# Altium project ControlPlate_V0.03.PrjPcb
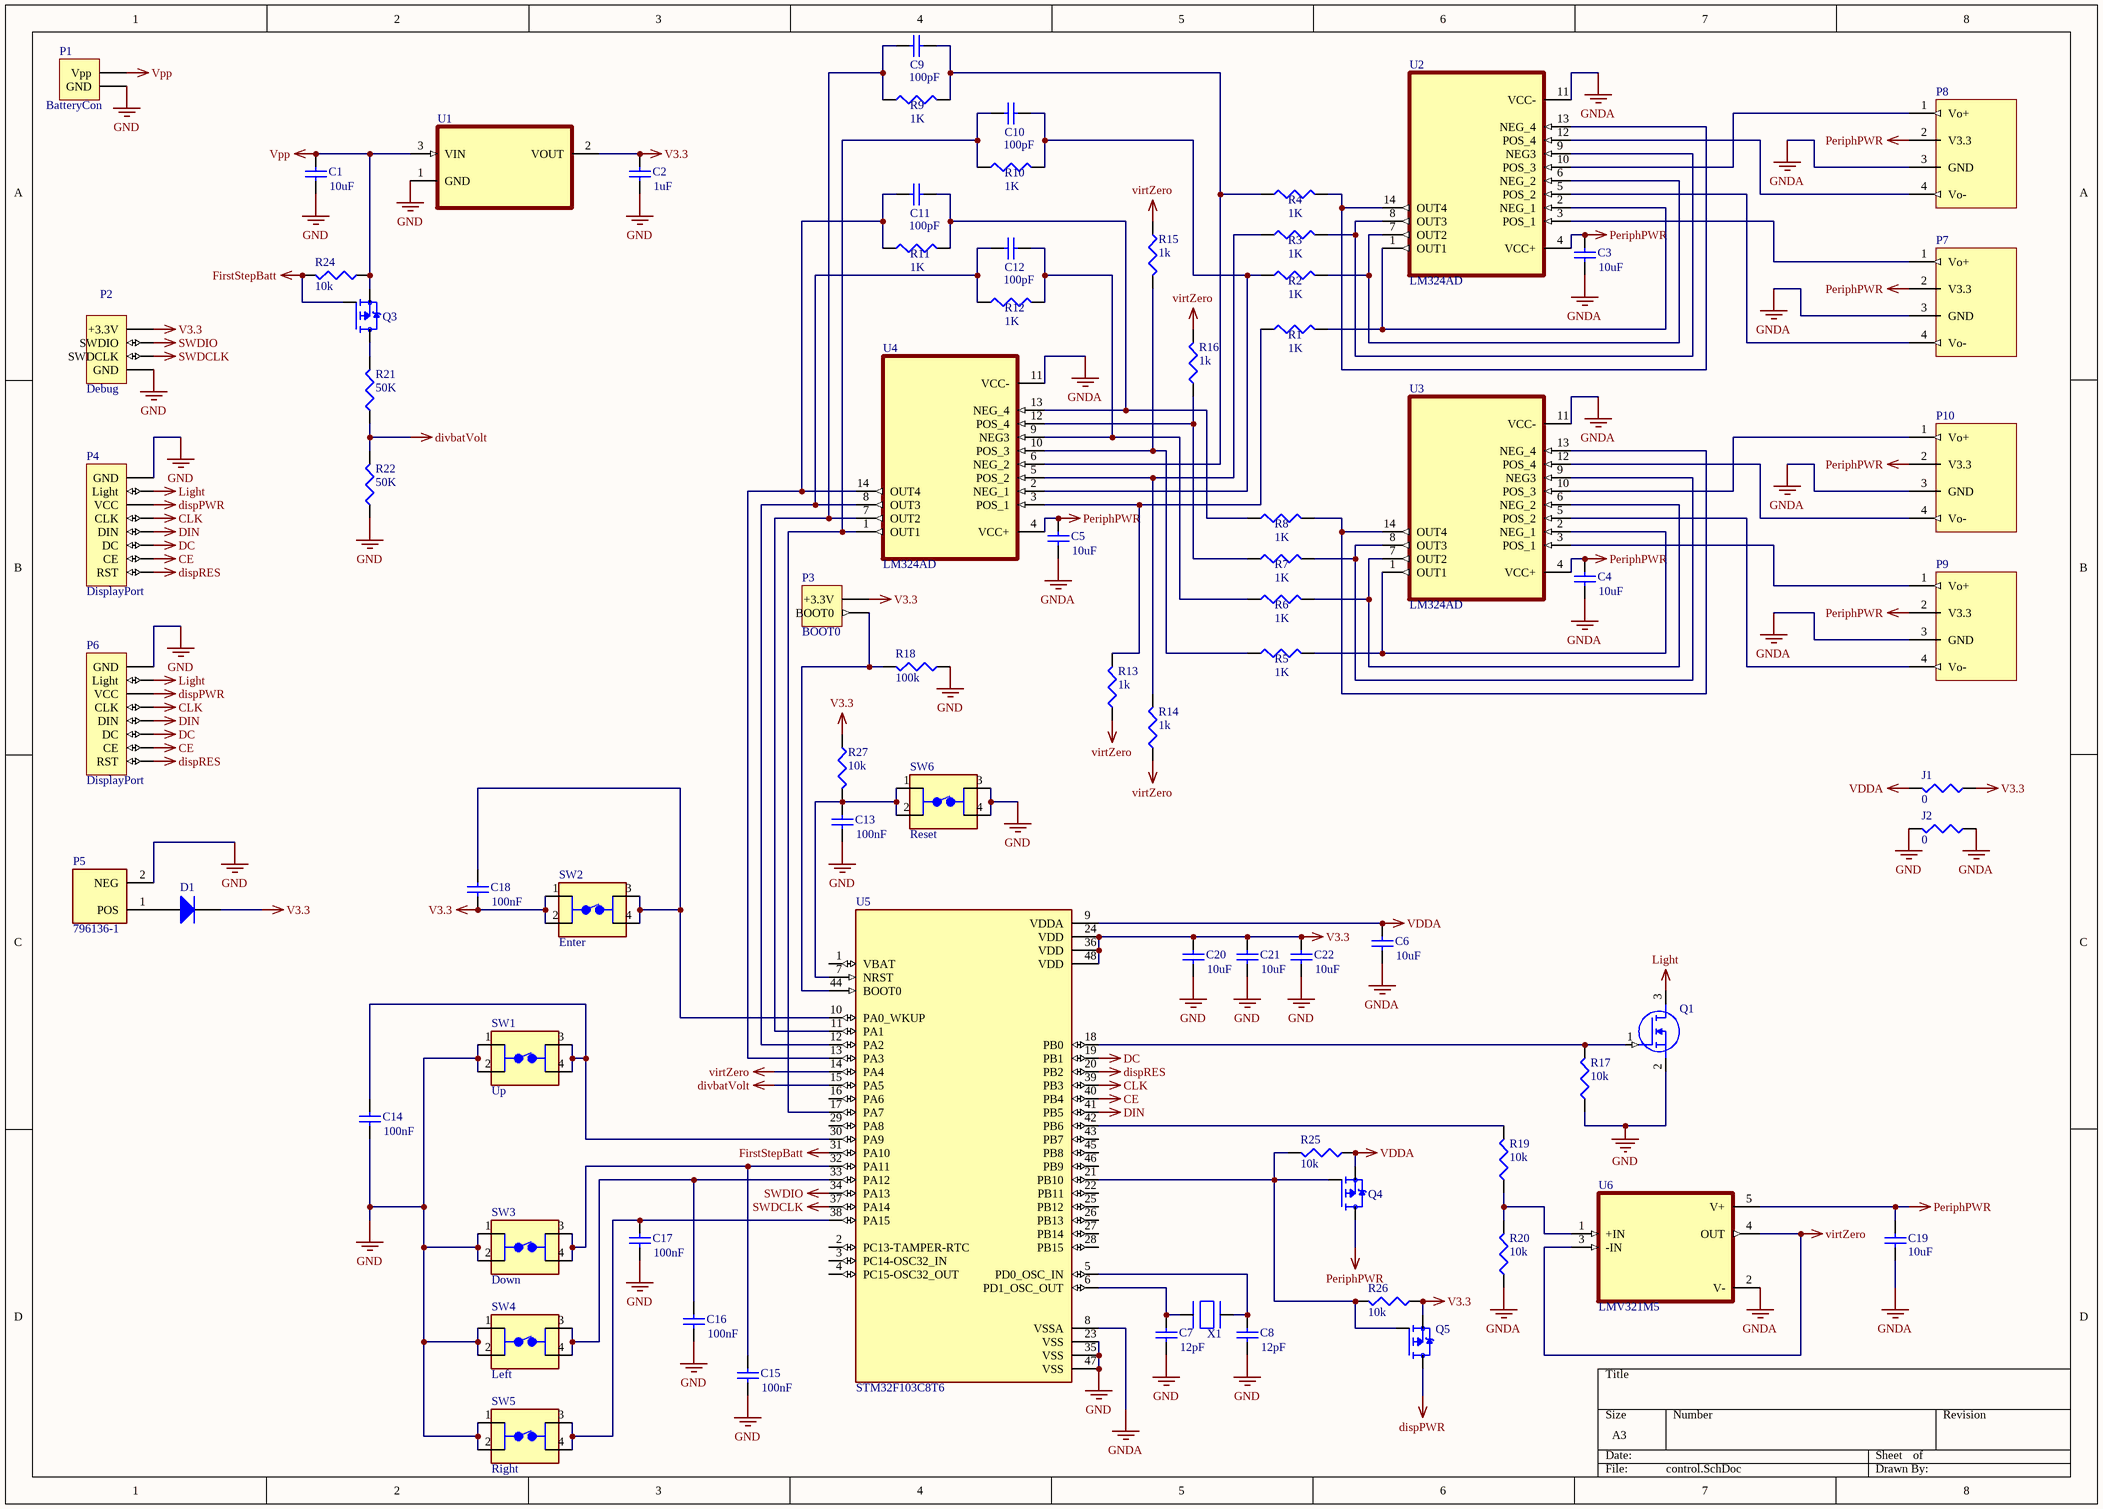
[diagram p0: control.SchDoc]
1 sheet, 78 parts. Net scope: global (net labels, ports and power ports of the same name join across sheets).
Board file: control.PcbDoc

## Sheet control.SchDoc
size A3; CheckedBy: Harakivi; Author: Harakivi; DrawnBy: Harakivi

### Parts
C1  value 10uF  [C1206]  (hidden comment: Cap Semi)
C2  value 1uF  [C1206]  (hidden comment: Cap Semi)
C3  value 10uF  [C1206]  (hidden comment: Cap Semi)
C4  value 10uF  [C1206]  (hidden comment: Cap Semi)
C5  value 10uF  [C1206]  (hidden comment: Cap Semi)
C6  value 10uF  [C1206]  (hidden comment: Cap Semi)
C7  value 12pF  [C1206]  (hidden comment: Cap Semi)
C8  value 12pF  [C1206]  (hidden comment: Cap Semi)
C9  value 100pF  [C1206]  (hidden comment: Cap Semi)
C10  value 100pF  [C1206]  (hidden comment: Cap Semi)
C11  value 100pF  [C1206]  (hidden comment: Cap Semi)
C12  value 100pF  [C1206]  (hidden comment: Cap Semi)
C13  value 100nF  [C1206]  (hidden comment: Cap Semi)
C14  value 100nF  [C1206]  (hidden comment: Cap Semi)
C15  value 100nF  [C1206]  (hidden comment: Cap Semi)
C16  value 100nF  [C1206]  (hidden comment: Cap Semi)
C17  value 100nF  [C1206]  (hidden comment: Cap Semi)
C18  value 100nF  [C1206]  (hidden comment: Cap Semi)
C19  value 10uF  [C1206]  (hidden comment: Cap Semi)
C20  value 10uF  [C1206]  (hidden comment: Cap Semi)
C21  value 10uF  [C1206]  (hidden comment: Cap Semi)
C22  value 10uF  [C1206]  (hidden comment: Cap Semi)
D1  Diode  [SMC]  (value not drawn)
J1  value 0  [14-1210]  (hidden comment: Res3)
J2  value 0  [14-1210]  (hidden comment: Res3)
P1  BatteryCon  [HDR1X2]
P2  Debug  [HDR1X4]
P3  BOOT0  [HDR1X2]
P4  DisplayPort  [HDR1X8]
P5  796136-1  [TE_796136-1]
P6  DisplayPort  [HDR1X8]
P7  Conn  [ConnFoot]  (value not drawn)
P8  Conn  [ConnFoot]  (value not drawn)
P9  Conn  [ConnFoot]  (value not drawn)
P10  Conn  [ConnFoot]  (value not drawn)
Q1  IRLML0030TRPBF  [SOT23_L]  (value not drawn)
Q3  IRLML9301TRPBF  [SOT95P237X112-3N]  (value not drawn)
Q4  IRLML9301TRPBF  [SOT95P237X112-3N]  (value not drawn)
Q5  IRLML9301TRPBF  [SOT95P237X112-3N]  (value not drawn)
R1  value 1K  [14-1210]  (hidden comment: Res3)
R2  value 1K  [14-1210]  (hidden comment: Res3)
R3  value 1K  [14-1210]  (hidden comment: Res3)
R4  value 1K  [14-1210]  (hidden comment: Res3)
R5  value 1K  [14-1210]  (hidden comment: Res3)
R6  value 1K  [14-1210]  (hidden comment: Res3)
R7  value 1K  [14-1210]  (hidden comment: Res3)
R8  value 1K  [14-1210]  (hidden comment: Res3)
R9  value 1K  [14-1210]  (hidden comment: Res3)
R10  value 1K  [14-1210]  (hidden comment: Res3)
R11  value 1K  [14-1210]  (hidden comment: Res3)
R12  value 1K  [14-1210]  (hidden comment: Res3)
R13  value 1k  [14-1210]  (hidden comment: Res3)
R14  value 1k  [14-1210]  (hidden comment: Res3)
R15  value 1k  [14-1210]  (hidden comment: Res3)
R16  value 1k  [14-1210]  (hidden comment: Res3)
R17  value 10k  [14-1210]  (hidden comment: Res3)
R18  value 100k  [14-1210]  (hidden comment: Res3)
R19  value 10k  [14-1210]  (hidden comment: Res3)
R20  value 10k  [14-1210]  (hidden comment: Res3)
R21  value 50K  [14-1210]  (hidden comment: Res3)
R22  value 50K  [14-1210]  (hidden comment: Res3)
R24  value 10k  [14-1210]  (hidden comment: Res3)
R25  value 10k  [14-1210]  (hidden comment: Res3)
R26  value 10k  [14-1210]  (hidden comment: Res3)
R27  value 10k  [14-1210]  (hidden comment: Res3)
SW1  Up  [TE_FSM4JSMA]
SW2  Enter  [TE_FSM4JSMA]
SW3  Down  [TE_FSM4JSMA]
SW4  Left  [TE_FSM4JSMA]
SW5  Right  [TE_FSM4JSMA]
SW6  Reset  [TE_FSM4JSMA]
U1  MCP1702T-3302E/CB  [SOT95P255X145-3N]  (value not drawn)
U2  LM324AD  [SOIC127P600X175-14N]
U3  LM324AD  [SOIC127P600X175-14N]
U4  LM324AD  [SOIC127P600X175-14N]
U5  STM32F103C8T6  [QFP50P900X900X160-48N]
U6  LMV321M5  [SOT95P280X145-5N]
X1  ABLS-8.000MHZ-B4-T  [HC-49/US]  (value not drawn)

### Nets
CE: P4.2(CE) P6.2(CE) U5.40(PB4)
CLK: P4.5(CLK) P6.5(CLK) U5.39(PB3)
DC: P4.3(DC) P6.3(DC) U5.19(PB1)
DIN: P4.4(DIN) P6.4(DIN) U5.41(PB5)
dispPWR: P4.6(VCC) P6.6(VCC) Q5.3(D)
dispRES: P4.1(RST) P6.1(RST) U5.20(PB2)
divbatVolt: R21.1 R22.2 U5.15(PA5)
FirstStepBatt: Q3.1(G) R24.2 U5.31(PA10)
GND: C1.1 C2.1 C7.1 C8.1 C13.1 C14.1 C15.1 C16.1 C17.1 C20.1 C21.1 C22.1 J2.2 P1.1(GND) P2.1(GND) P4.8(GND) P5.2(NEG) P6.8(GND) Q1.2(S) R17.1 R18.1 R22.1 SW1.1 SW1.2 SW3.1 SW3.2 SW4.1 SW4.2 SW5.1 SW5.2 SW6.3 SW6.4 U1.1(GND) U5.23(VSS) U5.35(VSS) U5.47(VSS)
GNDA: C3.1 C4.1 C5.1 C6.1 C19.2 J2.1 P7.3(GND) P8.3(GND) P9.3(GND) P10.3(GND) R20.1 U2.11(VCC-) U3.11(VCC-) U4.11(VCC-) U5.8(VSSA) U6.2(V-)
Light: P4.7(Light) P6.7(Light) Q1.3(D)
PeriphPWR: C3.2 C4.2 C5.2 C19.1 P7.2(V3.3) P8.2(V3.3) P9.2(V3.3) P10.2(V3.3) Q4.3(D) U2.4(VCC+) U3.4(VCC+) U4.4(VCC+) U6.5(V+)
SWDCLK: P2.2(SWDCLK) U5.37(PA14)
SWDIO: P2.3(SWDIO) U5.34(PA13)
V3.3: C2.2 C18.1 C20.2 C21.2 C22.2 D1.2(K) J1.1 P2.4(+3.3V) P3.2(+3.3V) Q5.2(S) R26.1 R27.1 SW2.1 SW2.2 U1.2(VOUT) U5.24(VDD) U5.36(VDD) U5.48(VDD)
VDDA: C6.2 J1.2 Q4.2(S) R25.1 U5.9(VDDA)
virtZero: R13.1 R14.1 R15.1 R16.2 U5.14(PA4) U6.3(-IN) U6.4(OUT)
Vpp: C1.2 P1.2(Vpp) Q3.2(S) R24.1 U1.3(VIN)
NetC7_2: C7.2 U5.6(PD1_OSC_OUT) X1.P$1
NetC8_2: C8.2 U5.5(PD0_OSC_IN) X1.P$2
NetC9_1: C9.1 R9.1 U4.7(OUT2) U5.11(PA1)
NetC9_2: C9.2 R4.1 R9.2 U4.6(NEG_2)
NetC10_1: C10.1 R10.1 U4.1(OUT1) U5.17(PA7)
NetC10_2: C10.2 R2.1 R10.2 U4.2(NEG_1)
NetC11_1: C11.1 R11.1 U4.14(OUT4) U5.13(PA3)
NetC11_2: C11.2 R8.1 R11.2 U4.13(NEG_4)
NetC12_1: C12.1 R12.1 U4.8(OUT3) U5.12(PA2)
NetC12_2: C12.2 R6.1 R12.2 U4.9(NEG3)
NetC13_2: C13.2 R27.2 SW6.1 SW6.2 U5.7(NRST)
NetC14_2: C14.2 SW1.3 SW1.4 U5.30(PA9)
NetC15_2: C15.2 SW3.3 SW3.4 U5.32(PA11)
NetC16_2: C16.2 SW4.3 SW4.4 U5.33(PA12)
NetC17_2: C17.2 SW5.3 SW5.4 U5.38(PA15)
NetC18_2: C18.2 SW2.3 SW2.4 U5.10(PA0_WKUP)
NetD1_1: D1.1(A) P5.1(POS)
NetP3_1: P3.1(BOOT0) R18.2 U5.44(BOOT0)
NetP7_1: P7.1(Vo+) U2.3(POS_1)
NetP7_4: P7.4(Vo-) U2.5(POS_2)
NetP8_1: P8.1(Vo+) U2.10(POS_3)
NetP8_4: P8.4(Vo-) U2.12(POS_4)
NetP9_1: P9.1(Vo+) U3.3(POS_1)
NetP9_4: P9.4(Vo-) U3.5(POS_2)
NetP10_1: P10.1(Vo+) U3.10(POS_3)
NetP10_4: P10.4(Vo-) U3.12(POS_4)
NetQ1_1: Q1.1(G) R17.2 U5.18(PB0)
NetQ3_3: Q3.3(D) R21.2
NetQ4_1: Q4.1(G) Q5.1(G) R25.2 R26.2 U5.21(PB10)
NetR1_1: R1.1 R13.2 U4.3(POS_1)
NetR1_2: R1.2 U2.1(OUT1) U2.2(NEG_1)
NetR2_2: R2.2 U2.6(NEG_2) U2.7(OUT2)
NetR3_1: R3.1 R14.2 U4.5(POS_2)
NetR3_2: R3.2 U2.8(OUT3) U2.9(NEG3)
NetR4_2: R4.2 U2.13(NEG_4) U2.14(OUT4)
NetR5_1: R5.1 R15.2 U4.10(POS_3)
NetR5_2: R5.2 U3.1(OUT1) U3.2(NEG_1)
NetR6_2: R6.2 U3.6(NEG_2) U3.7(OUT2)
NetR7_1: R7.1 R16.1 U4.12(POS_4)
NetR7_2: R7.2 U3.8(OUT3) U3.9(NEG3)
NetR8_2: R8.2 U3.13(NEG_4) U3.14(OUT4)
NetR19_1: R19.1 R20.2 U6.1(+IN)
NetR19_2: R19.2 U5.42(PB6)

Not connected (* = marked no-connect by the designer): U5 1(VBAT) 2(PC13-TAMPER-RTC) 3(PC14-OSC32_IN) 4(PC15-OSC32_OUT) 16(PA6) 22(PB11) 25(PB12) 26(PB13) 27(PB14) 28(PB15) 29(PA8) 43(PB7) 45(PB8) 46(PB9)

### Library data of the parts
C1-C22 = Cap Semi: Capacitor (Semiconductor SIM Model); Published: 8-Jun-2000; LatestRevisionDate: 29-May-2009; LatestRevisionNote: IPC-7351 Footprint Added.; PackageReference: C1206; Publisher: Altium Limited; PackageDescription: Chip Capacitor
D1 = Diode: Default Diode; Published: 8-Jun-2000; LatestRevisionDate: 17-Jul-2002; LatestRevisionNote: Re-released for DXP Platform.; PackageVersion: Sep-1996; PackageReference: SMC; Publisher: Altium Limited; PackageDescription: DO-214-AB/SMC; 2 C-Bend Leads; Body 7.9 x 5.9 mm, inc. leads (LxW); Code_JEDEC: DO-214-AB
J1 J2 R1-R22 R24-R27 = Res3: Resistor; Published: 8-Jun-2000; LatestRevisionDate: 29-May-2009; LatestRevisionNote: IPC-7351 Footprint Added.; PackageReference: J1-0603; Publisher: Altium Limited; PackageDescription: Chip Resistor
P1 P3 = Header 2: Header, 2-Pin; LatestRevisionDate: 17-Jul-2002; LatestRevisionNote: Re-released for DXP Platform.; Publisher: Altium Limited
P2 = Header 4: Header, 4-Pin; LatestRevisionDate: 17-Jul-2002; LatestRevisionNote: Re-released for DXP Platform.; Publisher: Altium Limited
P4 P6 = Header 8: Header, 8-Pin; LatestRevisionDate: 17-Jul-2002; LatestRevisionNote: Re-released for DXP Platform.; Publisher: Altium Limited
P5 = 796136-1: BATTERY HOLDER; No. of Batteries:1; Terminal Type:Surface Mount; For Use With:CR2032 Batteries; Accessory Type:Battery Holder; Battery Size Code:2032; Number_of_Positions: 2; MF: TE Connectivity; Package: None; Value: *; TE_purchase_URL: https://www.te.com/usa-en/product-796136-1.html?te_bu=Cor&te_type=disp&te_campaign=seda_glo_cor-seda-global-disp-prtnr-fy19-seda-model-bom-cta_sma-317_1&elqCampaignId=32493; EU_RoHS_Compliance: Compliant; SnapEDA_Link: https://www.snapeda.com/parts/796136-1/TE%20Connectivity%20AMP%20Connectors/view-part/761452/?ref=snap; Availability: Unavailable; Price: None; MP: 796136-1
P7-P10 = ConnectorSMD
Q1 = IRLML0030TRPBF: N-Channel 30V 5.3A _Ta_ 1.3W _Ta_ Surface Mount Micro3â„¢/SOT-23; pin to pad: 1>3 3>1; MF: Infineon Technologies; MP: IRLML0030TRPBF; SnapEDA_Link: https://www.snapeda.com/parts/IRLML0030TRPBF/Infineon%20Technologies/view-part/246217/?ref=snap; Price: None; Availability: Unavailable; Package: SOT-23 International Rectifier; Value: *
Q3-Q5 = IRLML9301TRPBF: RoHS Compliant | Low RDS_on_ | Industry-Standard Pinout | Compatible with Existing Surface Mount Techniques | Qualified MSL1 | P-Channel MOSFET | SOT-23 Footprint; MF: Infineon Technologies; Value: *; Package: SOT-23 Infineon; Price: None; MP: IRLML9301TRPBF; Availability: Unavailable; SnapEDA_Link: https://www.snapeda.com/parts/IRLML9301TRPBF/Infineon%20Technologies/view-part/2598123/?ref=snap
SW1-SW6 = FSM4JSMA: Tactile Switch SPST-NO Top Actuated Surface Mount; Contact_Current_Rating: 50 mA; Configuration_Pole-Throw: Single Pole - Single Throw; MF: TE Connectivity; SnapEDA_Link: https://www.snapeda.com/parts/FSM4JSMA/TE%20Connectivity%20ALCOSWITCH%20Switches/view-part/543632/?ref=snap; Availability: Unavailable; TE_purchase_URL: https://www.te.com/usa-en/product-4-1437565-1.html?te_bu=Cor&te_type=disp&te_campaign=seda_glo_cor-seda-global-disp-prtnr-fy19-seda-model-bom-cta_sma-317_1&elqCampaignId=32493; MP: FSM4JSMA; EU_RoHS_Compliance: Compliant; Price: None; Value: *; Package: None
U1 = MCP1702T-3302E/CB: Linear Voltage Regulator IC Positive Fixed 1 Output 250mA SOT-23A-3; MF: Microchip Technology; Check_prices: https://www.snapeda.com/parts/MCP1702T-3302E/CB/Atmel/view-part/?ref=eda; Availability: In Stock; Price: None; Package: None; Value: *; Purchase-URL: https://pricing.snapeda.com/search/part/MCP1702T-3302E/CB/?ref=eda; SnapEDA_Link: https://www.snapeda.com/parts/MCP1702T-3302E/CB/Atmel/view-part/?ref=snap; MP: MCP1702T-3302E/CB
U2-U4 = LM324AD: Op Amp Quad Low Power Amplifier Â±15V/30V 14-Pin SOIC Tube; MF: Texas Instruments; Value: *; Price: None; Package: None; Availability: Unavailable; MP: LM324AD; SnapEDA_Link: https://www.snapeda.com/parts/LM324AD/Texas%20Instruments/view-part/4804679/?ref=snap
U5 = STM32F103C8T6: ARMÂ® CortexÂ®-M3 STM32F1 Microcontroller IC 32-Bit 72MHz 64KB _64K x 8_ FLASH; MF: STMicroelectronics; Price: None; Package: LQFP-48 STMicroelectronics; Value: *; MP: STM32F103C8T6; Availability: Unavailable; SnapEDA_Link: https://www.snapeda.com/parts/STM32F103C8T6/STMicroelectronics/view-part/52195/?ref=snap
U6 = LMV321M5: Single channel general purpose, low voltage, rail-to-rail output operational amplifiers 5-SOT-23 -40 to 125; MP: LMV321M5/NOPB; MF: Texas Instruments; DigiKey-Purchase-URL: https://snapeda.com/shop?store=DigiKey&id=16808; SnapEDA_Link: https://www.snapeda.com/parts/LMV321M5/NOPB/Texas%20Instruments/view-part/16808/?ref=snap; Availability: Good; Arrow_Electronics-Purchase-URL: https://snapeda.com/shop?store=Arrow+Electronics&id=16808; Mouser-Purchase-URL: https://snapeda.com/shop?store=Mouser&id=16808; Package: SOT-23-5 Texas Instruments; Texas_Instruments-Purchase-URL: https://snapeda.com/shop?store=Texas+Instruments&id=16808; Value: *; Price: None; Check_prices: https://www.snapeda.com/parts/LMV321M5/NOPB/Texas%20Instruments/view-part/16808/?ref=eda
X1 = ABLS-8.000MHZ-B4-T: 8MHz Â±30ppm Crystal 18pF 80 Ohms HC-49/US; MF: Abracon LLC; Price: None; Package: HC-49/US Abracon LLC; Availability: Unavailable; SnapEDA_Link: https://www.snapeda.com/parts/ABLS-8.000MHZ-B4-T/Abracon%20LLC/view-part/306310/?ref=snap; Value: *; MP: ABLS-8.000MHZ-B4-T